# EAGLE design Eagle_Relay (EAGLE 7.2.0)
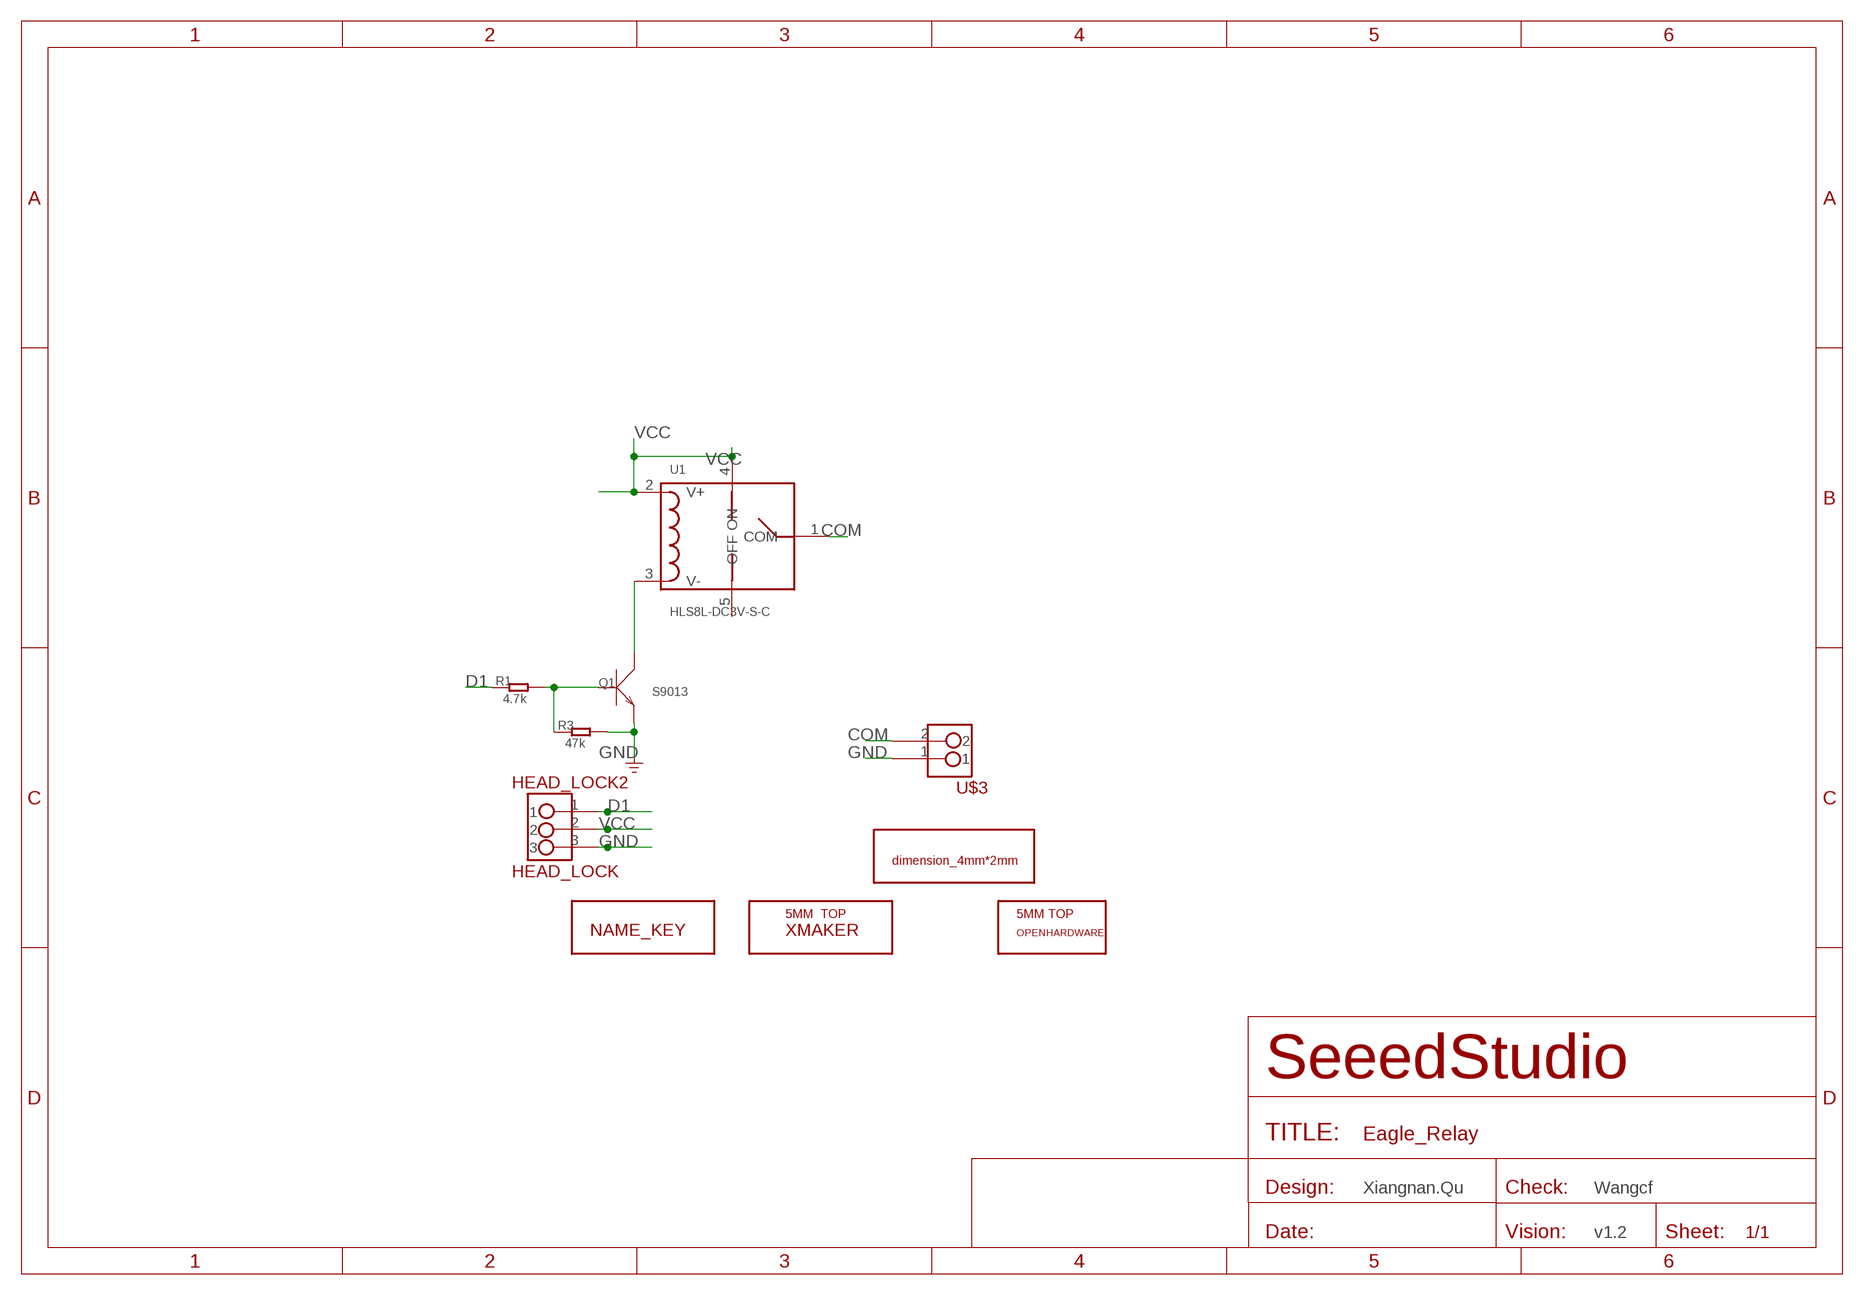
[diagram p0: schematic, sheet 1]

## Parts
HEAD_LOCK2  HEAD_LOCK  [HEAD_LOCK]
Q1  S9013  TRANSISTOR-NPN-SOT23  [SOT23]
R1  4.7k  R-0603  [R0603]
R3  47k  R-0603  [R0603]
U1  HLS8L-DC3V-S-C  RELAY  [RELAY]
U$2  XMAKERLOGO_5MM_TOP  [XMAKERLOGO_5MM_TOP]
U$3  HEAD_LOCK2  [HEAD_LOCK2]
U$5  NAME_RELAY  [NAME_RELAY]
U$6  DIMENSION_4MM2MM  [DIMENSION_2MM*4MM]
U$8  OPENHARDWARE_5MM_TOP  [OPENSOURCE_5MM_TOP]

## Nets
COM: U1.1(COM) U$3.2
D1: HEAD_LOCK2.1 R1.1
GND: HEAD_LOCK2.3 Q1.2(E) R3.2 U$3.1
N$2: Q1.1(B) R1.2 R3.1
VCC: HEAD_LOCK2.2 U1.2(V+) U1.4(ON)
VGND: Q1.3(C) U1.3(V-)
Unconnected: U1.5(OFF)

## Notes on the sheet
- Xiangnan.Qu | Wangcf
- v1.2

## Library data of the parts
HEAD_LOCK2 = Xmaker_yuhuilbr:HEAD_LOCK
Q1 = Discrete:TRANSISTOR-NPN*: NPN audion
R1 R3 = Discrete:R*
U1 = Seeed:RELAY
U$2 = Xmaker:XMAKERLOGO_5MM_TOP
U$3 = Xmaker_yuhuilbr:HEAD_LOCK2
U$5 = Xmaker:NAME_RELAY
U$6 = Xmaker_yuhui:DIMENSION_4MM*2MM
U$8 = Xmaker:OPENHARDWARE_5MM_TOP

## Board
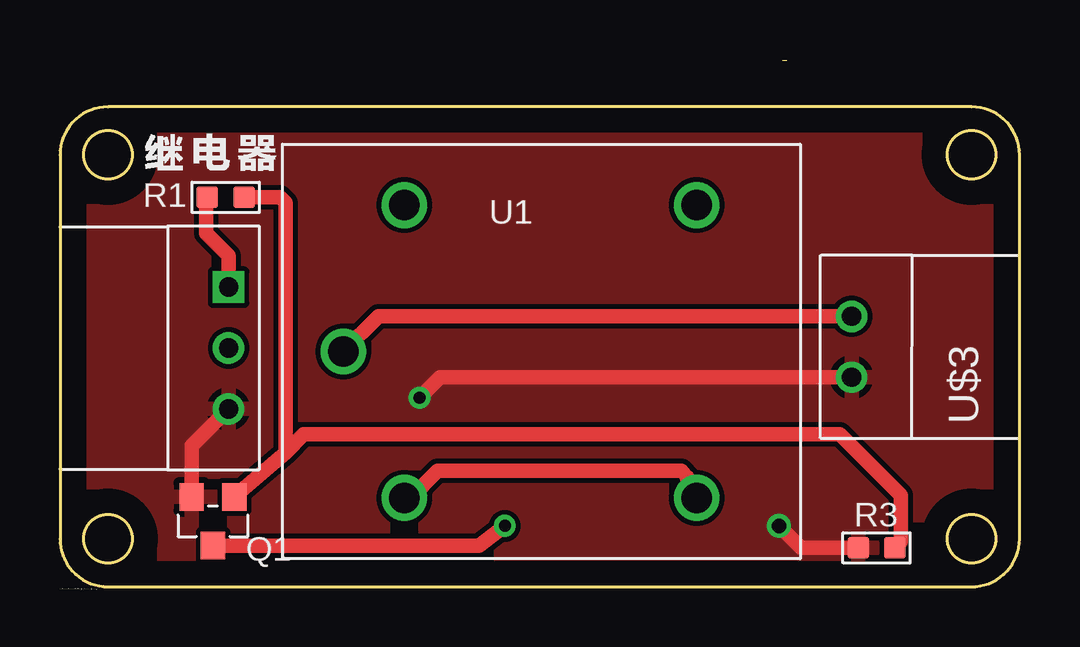
[diagram p1: board, top side]
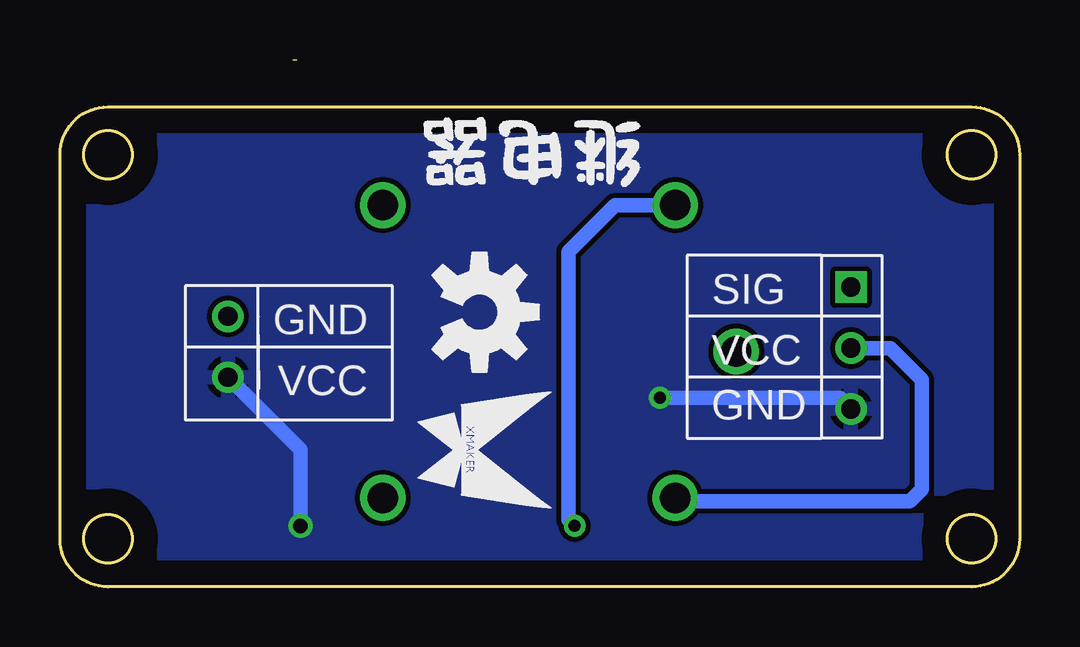
[diagram p2: board, bottom side, seen from below]

Size 40 x 21.95 mm. Coordinates in mm from the lower left corner, seen from the top.
Copper layers (1*16): Top 0.035mm / dielectric 1.5mm / Bottom 0.035mm
Design rules "default": minimum track width 10mil, minimum drill 24mil, track to track 8mil, track to pad 8mil, pad to pad 8mil, via to via 8mil, smd to smd 8mil, copper to edge 40mil, drill to drill 8mil, minimum pad ring 10mil, minimum via ring 8mil, stop-mask expansion 4mil, vias tented up to drill 0mil, thermal gap 10mil

### Footprints (pad centres in the part's own frame; a part is rotated, then mirrored left to right if it is on the bottom)
HEAD_LOCK = drill 0.8 square: 1 0.025,2.489 | drill 0.8: 2 0.025,-0.051; 3 0.025,-2.591
SOT23 = smd 1.016 x 1.143: 1 -0.889,-1.016; 2 0.889,-1.016; 3 0,1.016
R0603 = smd 0.889 x 0.889: 1 -0.762,0; 2 0.762,0
RELAY = drill 1.27: 1 -2.54,-6.096; 2 0,-12.192; 3 0,0; 4 12.192,-12.192; 5 12.192,0
HEAD_LOCK2 = drill 0.8: 1 0,1.27; 2 0,-1.27

### Placement (x,y rotation side)
HEAD_LOCK2  7,10 0 top
Q1  6.38,2.73 180 top
R1  6.91,16.22 0 top
R3  34.03,1.62 180 top
U1  14.35,15.9 0 top
U$2  22.51,5.7 270 bottom
U$3  33,10 180 top
U$5  20.32,19.81 180 bottom
U$6  0,0 0 top
U$8  22.51,11.44 270 bottom

### Tracks (layer width: path | path; a pad name or v marks a point on that pad's centre or on a via)
COM
  Top 0.61: U$3.2 13.28,11.27 U1.1
D1
  Top 0.61: HEAD_LOCK2.1 7.03,13.8 6.1,14.73 6.1,16.17 R1.1
GND  (via drill 0.5, 0.6)
  Top 0.61: 7.01,7.42 HEAD_LOCK2.3 5.49,5.88 Q1.2 | R3.2 30.89,1.62 v29.97,2.54 | U$3.1 15.84,8.73 v14.99,7.87
  Bottom 0.61: v29.97,2.54 29.97,5.7 U$3.1 | v14.99,7.87 7.49,7.87 HEAD_LOCK2.3
  pour Top: -0.3,20.12 40.36,20.12 40.36,20.09 40.59,20.09 40.59,-0.3 0,-0.3 0,-0.1 -0.41,-0.1
  pour Bottom: -1.42,21.56 41.83,21.56 41.83,20.98 42.82,21.56 42.9,-0.74 -1.88,-1.37 -1.88,-0.91 -1.7,-0.91 -1.7,21.64
N$2
  Top 0.61: R1.2 9.18,16.22 9.4,16 9.4,5.59 | Q1.1 9.14,5.37 9.4,5.59 | 9.4,5.59 10.16,6.35 32.51,6.35 35.05,3.81 35.05,1.87 R3.1
VCC
  Top 0.61: U1.2 14.63,3.71 15.75,4.83 25.91,4.83 26.16,4.57 26.16,4.09 U1.4
  Bottom 0.61: HEAD_LOCK2.2 5.38,9.95 4.06,8.64 4.06,4.06 4.57,3.56 14.2,3.56 U1.2
VGND  (via drill 0.5)
  Top 0.61: Q1.3 17.46,1.71 v18.54,2.54
  Bottom 0.61: U1.3 16.87,15.9 18.8,13.97 18.8,2.79 v18.54,2.54

### Text on the board
tPlace: Y:/Xmaker/XmakerPCB/Eagle_File/¼̵çÆ÷.bmp